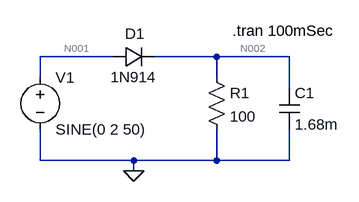
[diagram p0: schematic 8.asc]
8.asc, the LTspice schematic file:
Version 4
SHEET 1 880 680
WIRE 160 32 48 32
WIRE 320 32 224 32
WIRE 432 32 320 32
WIRE 48 64 48 32
WIRE 320 64 320 32
WIRE 432 80 432 32
WIRE 48 192 48 144
WIRE 192 192 48 192
WIRE 320 192 320 144
WIRE 320 192 192 192
WIRE 432 192 432 144
WIRE 432 192 320 192
WIRE 192 208 192 192
FLAG 192 208 0
SYMBOL voltage 48 48 R0
WINDOW 123 0 0 Left 0
WINDOW 39 0 0 Left 0
SYMATTR InstName V1
SYMATTR Value SINE(0 2 50)
SYMBOL diode 160 48 R270
WINDOW 0 36 34 VTop 2
WINDOW 3 0 32 VBottom 2
SYMATTR InstName D1
SYMATTR Value 1N914
SYMBOL res 304 48 R0
SYMATTR InstName R1
SYMATTR Value 100
SYMBOL cap 416 80 R0
SYMATTR InstName C1
SYMATTR Value 1.68m
TEXT 344 -8 Left 2 !.tran 100mSec

The netlist it stands for:
* 8.asc
V1 N001 0 SINE(0 2 50)
D1 N001 N002 1N914
R1 N002 0 100
C1 N002 0 1.68m
.model D D
.lib standard.dio
.tran 100mSec
.backanno
.end

* Results of the author's LTspice run, read from the files saved beside the schematic
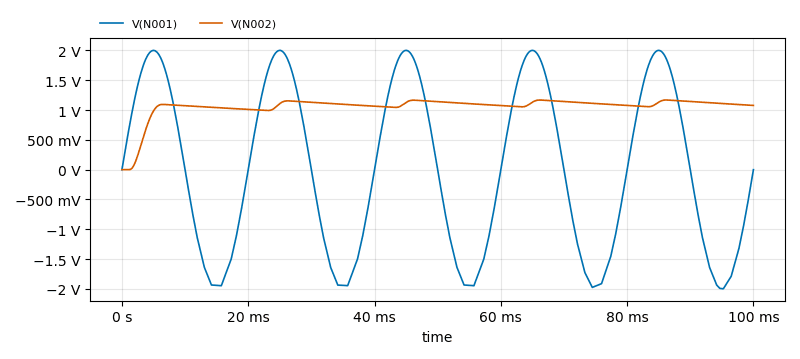
[diagram p1: Transient Analysis of 8.asc, plotted from the saved traces]
* Transient Analysis, 1 run:
*   V(N001): min -1.997 V, max 2 V, average 7.435 mV, rms 1.409 V, last 0 V
*   V(N002): min 0 V, max 1.168 V, average 1.058 V, rms 1.074 V, last 1.077 V